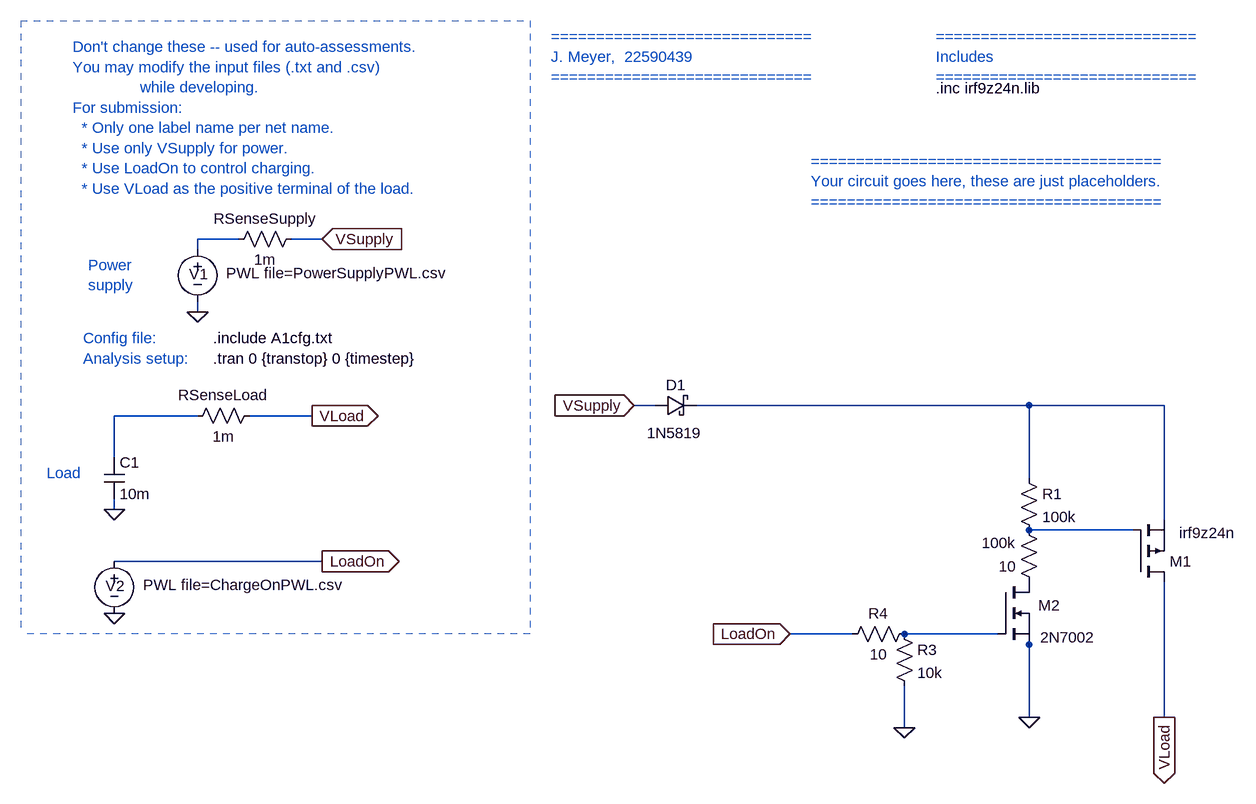
[diagram p0: schematic E344_22590439_A1.asc]
E344_22590439_A1.asc, the LTspice schematic file:
Version 4
SHEET 1 1824 680
WIRE -2032 -1088 -2096 -1088
WIRE -1904 -1088 -1952 -1088
WIRE -2096 -1072 -2096 -1088
WIRE -2096 -976 -2096 -992
WIRE -1392 -832 -1424 -832
WIRE -816 -832 -1328 -832
WIRE -608 -832 -816 -832
WIRE -2096 -816 -2224 -816
WIRE -1920 -816 -2016 -816
WIRE -2224 -752 -2224 -816
WIRE -816 -720 -816 -832
WIRE -2224 -672 -2224 -688
WIRE -608 -656 -608 -832
WIRE -656 -640 -816 -640
WIRE -1904 -592 -2224 -592
WIRE -1088 -480 -1184 -480
WIRE -864 -480 -1008 -480
WIRE -816 -464 -816 -480
WIRE -816 -352 -816 -464
WIRE -608 -352 -608 -560
WIRE -1008 -336 -1008 -400
FLAG -2096 -976 0
FLAG -1904 -1088 VSupply
IOPIN -1904 -1088 In
FLAG -1920 -816 VLoad
IOPIN -1920 -816 Out
FLAG -1904 -592 LoadOn
IOPIN -1904 -592 Out
FLAG -2224 -512 0
FLAG -1424 -832 VSupply
IOPIN -1424 -832 In
FLAG -608 -352 VLoad
IOPIN -608 -352 Out
FLAG -1184 -480 LoadOn
IOPIN -1184 -480 In
FLAG -2224 -672 0
FLAG -816 -352 0
FLAG -1008 -336 0
SYMBOL voltage -2096 -1088 R0
WINDOW 123 0 0 Left 0
WINDOW 39 0 0 Left 0
WINDOW 3 44 52 Left 2
WINDOW 0 -13 54 Left 2
SYMATTR Value PWL file=PowerSupplyPWL.csv
SYMATTR InstName V1
SYMBOL res -2000 -832 R90
WINDOW 0 0 56 VBottom 2
WINDOW 3 32 56 VTop 2
SYMATTR InstName RSenseLoad
SYMATTR Value 1m
SYMBOL res -2048 -1072 R270
WINDOW 0 32 56 VTop 2
WINDOW 3 0 56 VBottom 2
SYMATTR InstName RSenseSupply
SYMATTR Value 1m
SYMBOL cap -2240 -752 R0
SYMATTR InstName C1
SYMATTR Value 10m
SYMATTR SpiceLine2 IC=0
SYMBOL voltage -2224 -608 R0
WINDOW 123 0 0 Left 0
WINDOW 39 0 0 Left 0
WINDOW 3 44 52 Left 2
WINDOW 0 -13 54 Left 2
SYMATTR Value PWL file=ChargeOnPWL.csv
SYMATTR InstName V2
SYMBOL pmos -656 -560 M180
WINDOW 3 71 76 Left 2
SYMATTR Value irf9z24n
SYMATTR InstName M1
SYMATTR Prefix X
SYMATTR SpiceModel irf9z24n
SYMBOL nmos -864 -560 R0
WINDOW 0 62 36 Left 2
WINDOW 3 65 85 Left 2
SYMATTR InstName M2
SYMATTR Value 2N7002
SYMBOL schottky -1392 -816 R270
WINDOW 0 32 32 VTop 2
WINDOW 3 -11 30 VBottom 2
SYMATTR InstName D1
SYMATTR Value 1N5819
SYMATTR Description Diode
SYMATTR Type diode
SYMBOL res -832 -736 R0
SYMATTR InstName R1
SYMATTR Value 100k
SYMBOL res -800 -544 R180
WINDOW 0 36 76 Left 2
WINDOW 3 36 40 Left 2
SYMATTR InstName 100k
SYMATTR Value 10
SYMBOL res -1024 -496 R0
SYMATTR InstName R3
SYMATTR Value 10k
SYMBOL res -992 -496 R90
WINDOW 0 0 56 VBottom 2
WINDOW 3 32 56 VTop 2
SYMATTR InstName R4
SYMATTR Value 10
TEXT -2072 -904 Left 2 !.tran 0 {transtop} 0 {timestep}
TEXT -2072 -936 Left 2 !.include A1cfg.txt
TEXT -2288 -1384 Left 2 ;Don't change these -- used for auto-assessments.\nYou may modify the input files (.txt and .csv) \n               while developing.\nFor submission: \n  * Only one label name per net name.\n  * Use only VSupply for power.\n  * Use LoadOn to control charging.\n  * Use VLoad as the positive terminal of the load.
TEXT -2272 -936 Left 2 ;Config file:
TEXT -2272 -904 Left 2 ;Analysis setup:
TEXT -2328 -728 Left 2 ;Load
TEXT -2264 -1048 Left 2 ;Power\nsupply
TEXT -1552 -1400 Left 2 ;=============================\nJ. Meyer,  22590439\n=============================
TEXT -960 -1320 Left 2 !.inc irf9z24n.lib
TEXT -960 -1400 Left 2 ;=============================\nIncludes\n=============================
TEXT -1152 -1208 Left 2 ;=======================================\nYour circuit goes here, these are just placeholders.\n=======================================
LINE Normal -1584 -1424 -1584 -480 2
LINE Normal -2368 -1424 -1584 -1424 2
LINE Normal -1584 -480 -2368 -480 2
LINE Normal -1584 -496 -1584 -496 2
LINE Normal -2368 -1424 -2368 -480 2

The netlist it stands for:
* E344_22590439_A1.asc
V1 N001 0 PWL file=PowerSupplyPWL.csv
RSenseLoad VLoad N003 1m
RSenseSupply N001 VSupply 1m
C1 N003 0 10m IC=0
V2 LoadOn 0 PWL file=ChargeOnPWL.csv
XM1 VLoad N004 N002 irf9z24n irf9z24n  ; pins D G S
M2 P001 N005 0 0 2N7002
D1 VSupply N002 1N5819
R1 N002 N004 100k
R§100k P001 N004 10
R3 N005 0 10k
R4 N005 LoadOn 10
.model D D
.lib standard.dio
.model NMOS NMOS
.model PMOS PMOS
.lib standard.mos
.tran 0 {transtop} 0 {timestep}
.include A1cfg.txt
* Don't change these -- used for auto-assessments.
* You may modify the input files (.txt and .csv)
*                while developing.
* For submission:
*   * Only one label name per net name.
*   * Use only VSupply for power.
*   * Use LoadOn to control charging.
*   * Use VLoad as the positive terminal of the load.
* Config file:
* Analysis setup:
* Load
* Power
* supply
* =============================
* J. Meyer,  22590439
* =============================
.inc irf9z24n.lib
* =============================
* Includes
* =============================
* =======================================
* Your circuit goes here, these are just placeholders.
* =======================================
.backanno
.end